# Altium schematic sheet NUCLEO-F410RB-Input.SchDoc
size A4
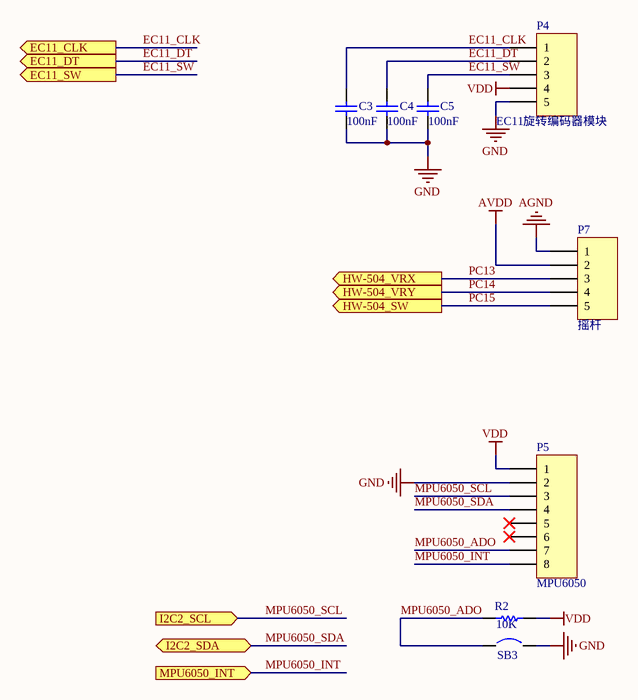
[diagram p0: NUCLEO-F410RB-Input.SchDoc]

## Parts
C3  value 100nF  [C0603]  (hidden comment: Cap)
C4  value 100nF  [C0603]  (hidden comment: Cap)
C5  value 100nF  [C0603]  (hidden comment: Cap)
P4  EC11旋转编码器模块  [HDR1X5-Male]
P5  MPU6050  [HDR1X8]
P7  摇杆  [HDR1X5-Male]
R2  value 10K  [R0603]  (hidden comment: Res_US)
SB3  Circuit Breaker  [JP2_SMD]  (value not drawn)

## Ports
EC11_CLK (out), EC11_DT (out), EC11_SW (out), HW-504_SW (out), HW-504_VRX (out), HW-504_VRY (out), I2C2_SCL (in), I2C2_SDA (bidir), MPU6050_INT (in)

## Nets
AGND: P7.1
AVDD: P7.2
GND: C3.1 C4.1 C5.1 P4.5 P5.2 SB3.2
VDD: P4.4 P5.1 R2.2
EC11_CLK: C3.2 P4.1 ; port EC11_CLK
EC11_DT: C4.2 P4.2 ; port EC11_DT
EC11_SW: C5.2 P4.3 ; port EC11_SW
MPU6050_ADO: P5.7 R2.1 SB3.1
MPU6050_INT: P5.8 ; port MPU6050_INT
MPU6050_SCL: P5.3 ; port I2C2_SCL
MPU6050_SDA: P5.4 ; port I2C2_SDA
PC13: P7.3 ; port HW-504_VRX
PC14: P7.4 ; port HW-504_VRY
PC15: P7.5 ; port HW-504_SW

Not connected (* = marked no-connect by the designer): P5 5* 6*

## Library data of the parts
C3-C5 = Cap: 无极性电容; Published: 8-Jun-2000; LatestRevisionDate: 17-Jul-2002; LatestRevisionNote: Re-released for DXP Platform.; PackageReference: RAD-0.3; Publisher: Altium Limited; PackageDescription: Radial Cap, Thru-Hole; 2 Leads; 0.3 in Pin Spacing
P4 P7 = Header 5: Header, 5-Pin; LatestRevisionDate: 17-Jul-2002; LatestRevisionNote: Re-released for DXP Platform.; Publisher: Altium Limited
P5 = Header 8: Header, 8-Pin; LatestRevisionDate: 17-Jul-2002; LatestRevisionNote: Re-released for DXP Platform.; Publisher: Altium Limited
R2 = Res_US: Resistor; Published: 8-Jun-2000; LatestRevisionDate: 29-May-2009; LatestRevisionNote: IPC-7351 Footprint Added.; PackageReference: J1-0603; Publisher: Altium Limited; PackageDescription: Chip Resistor
SB3 = Circuit Breaker: Solder: NO; Published: 24-Mar-1999; Revision: July-2002: Re-released for DXP Platform.; Publisher: Altium Limited